# Altium schematic sheet LedPot.SchDoc
size A4; SheetNumber: 2; SheetTotal: 3; SPICEModelCachePPUOGEJA: <root> / <DocumentId>PPUOGEJA</DocumentId> / </root>
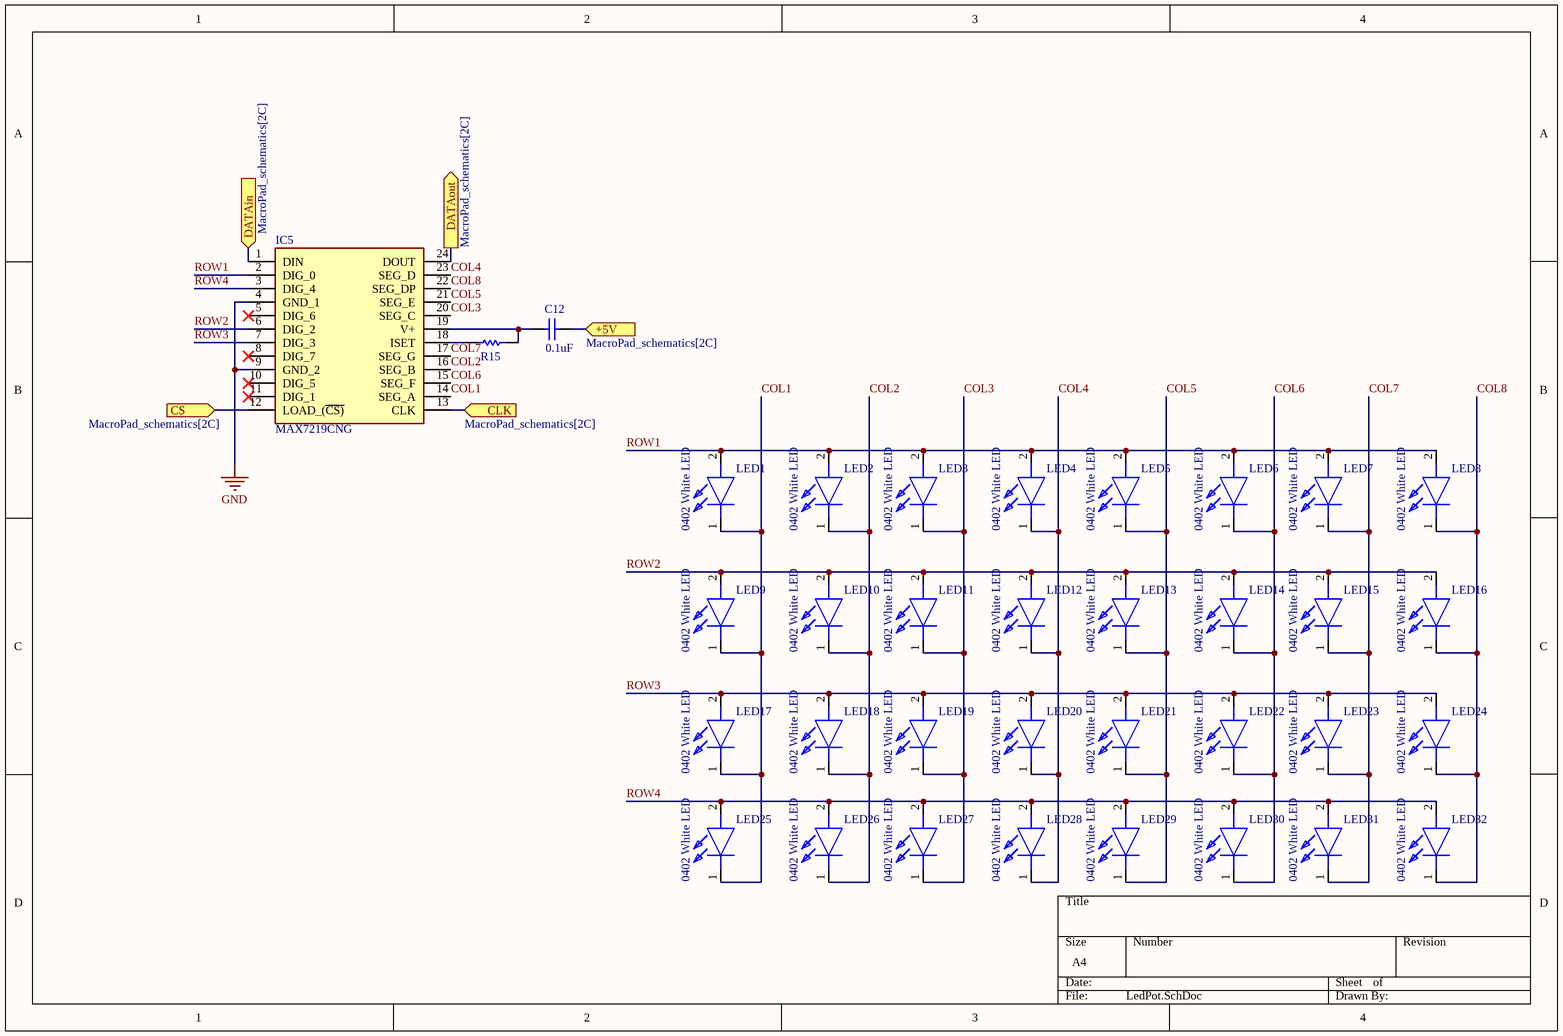
[diagram p0: LedPot.SchDoc]

## Parts
C12  value 0.1uF  [KEMT-1206-2_L]  (hidden comment: 1206 Capacitor)
IC5  MAX7219CNG  [DIP794W56P254L3054H457Q24N]
LED1  0402 White LED  [LWVH8GQ2OO4M6N1]
LED2  0402 White LED  [LWVH8GQ2OO4M6N1]
LED3  0402 White LED  [LWVH8GQ2OO4M6N1]
LED4  0402 White LED  [LWVH8GQ2OO4M6N1]
LED5  0402 White LED  [LWVH8GQ2OO4M6N1]
LED6  0402 White LED  [LWVH8GQ2OO4M6N1]
LED7  0402 White LED  [LWVH8GQ2OO4M6N1]
LED8  0402 White LED  [LWVH8GQ2OO4M6N1]
LED9  0402 White LED  [LWVH8GQ2OO4M6N1]
LED10  0402 White LED  [LWVH8GQ2OO4M6N1]
LED11  0402 White LED  [LWVH8GQ2OO4M6N1]
LED12  0402 White LED  [LWVH8GQ2OO4M6N1]
LED13  0402 White LED  [LWVH8GQ2OO4M6N1]
LED14  0402 White LED  [LWVH8GQ2OO4M6N1]
LED15  0402 White LED  [LWVH8GQ2OO4M6N1]
LED16  0402 White LED  [LWVH8GQ2OO4M6N1]
LED17  0402 White LED  [LWVH8GQ2OO4M6N1]
LED18  0402 White LED  [LWVH8GQ2OO4M6N1]
LED19  0402 White LED  [LWVH8GQ2OO4M6N1]
LED20  0402 White LED  [LWVH8GQ2OO4M6N1]
LED21  0402 White LED  [LWVH8GQ2OO4M6N1]
LED22  0402 White LED  [LWVH8GQ2OO4M6N1]
LED23  0402 White LED  [LWVH8GQ2OO4M6N1]
LED24  0402 White LED  [LWVH8GQ2OO4M6N1]
LED25  0402 White LED  [LWVH8GQ2OO4M6N1]
LED26  0402 White LED  [LWVH8GQ2OO4M6N1]
LED27  0402 White LED  [LWVH8GQ2OO4M6N1]
LED28  0402 White LED  [LWVH8GQ2OO4M6N1]
LED29  0402 White LED  [LWVH8GQ2OO4M6N1]
LED30  0402 White LED  [LWVH8GQ2OO4M6N1]
LED31  0402 White LED  [LWVH8GQ2OO4M6N1]
LED32  0402 White LED  [LWVH8GQ2OO4M6N1]
R15  0402 Resistor  [RESC1005X40X25ML05T05]  (value not drawn)

## Ports
+5V (in, see MacroPad_schematics[2C]), CLK (in, see MacroPad_schematics[2C]), CS (in, see MacroPad_schematics[2C]), DATAin (in, see MacroPad_schematics[2C]), DATAout (out, see MacroPad_schematics[2C])

## Nets
GND: IC5.4(GND_1) IC5.9(GND_2)
+5V: C12.2 ; port +5V
CLK: IC5.13(CLK) ; port CLK
COL1: IC5.14(SEG_A) LED1.1(K) LED9.1(K) LED17.1(K) LED25.1(K)
COL2: IC5.16(SEG_B) LED2.1(K) LED10.1(K) LED18.1(K) LED26.1(K)
COL3: IC5.20(SEG_C) LED3.1(K) LED11.1(K) LED19.1(K) LED27.1(K)
COL4: IC5.23(SEG_D) LED4.1(K) LED12.1(K) LED20.1(K) LED28.1(K)
COL5: IC5.21(SEG_E) LED5.1(K) LED13.1(K) LED21.1(K) LED29.1(K)
COL6: IC5.15(SEG_F) LED6.1(K) LED14.1(K) LED22.1(K) LED30.1(K)
COL7: IC5.17(SEG_G) LED7.1(K) LED15.1(K) LED23.1(K) LED31.1(K)
COL8: IC5.22(SEG_DP) LED8.1(K) LED16.1(K) LED24.1(K) LED32.1(K)
CS: IC5.12(LOAD_(~{CS)}) ; port CS
DATAin: IC5.1(DIN) ; port DATAin
DATAout: IC5.24(DOUT) ; port DATAout
ROW1: IC5.2(DIG_0) LED1.2(A) LED2.2(A) LED3.2(A) LED4.2(A) LED5.2(A) LED6.2(A) LED7.2(A) LED8.2(A)
ROW2: IC5.6(DIG_2) LED9.2(A) LED10.2(A) LED11.2(A) LED12.2(A) LED13.2(A) LED14.2(A) LED15.2(A) LED16.2(A)
ROW3: IC5.7(DIG_3) LED17.2(A) LED18.2(A) LED19.2(A) LED20.2(A) LED21.2(A) LED22.2(A) LED23.2(A) LED24.2(A)
ROW4: IC5.3(DIG_4) LED25.2(A) LED26.2(A) LED27.2(A) LED28.2(A) LED29.2(A) LED30.2(A) LED31.2(A) LED32.2(A)
NetC12_1: C12.1 IC5.19(V+) R15.2
NetIC5_18: IC5.18(ISET) R15.1

Not connected (* = marked no-connect by the designer): IC5 5(DIG_6)* 8(DIG_7)* 10(DIG_5)* 11(DIG_1)*

## Library data of the parts
C12 = CMP-001-00000-5: General Purpose Capacitor; Tolerance: 10%; Capacitor Type: Ceramic; Voltage Rating: 50V; Max Operating Temperature: 125°C; RoHS Compliant: Yes; Min Operating Temperature: -55°C; Case/Package: 1206
IC5 = MAX7219CNG: Integrated Circuit; Manufacturer_Name: Analog Devices; Datasheet Link: https://datasheets.maximintegrated.com/en/ds/MAX7219-MAX7221.pdf; Height: 4.572mm; Manufacturer_Part_Number: MAX7219CNG; Mouser Part Number: 700-MAX7219CNG-NR; Mouser Price/Stock: https://www.mouser.co.uk/ProductDetail/Analog-Devices-Maxim-Integrated/MAX7219CNG?qs=p6VZ%252BklCkRToQRlZGegBBA%3D%3D
LED1-LED32 = LW_VH8G-Q2OO-4M6N-1: LED; Manufacturer_Name: ams OSRAM; Manufacturer_Part_Number: LW VH8G-Q2OO-4M6N-1; Datasheet Link: https://look.ams-osram.com/m/6a061397583b7b2c/original/LW-VH8G.pdf; Height: 0.35mm; Mouser Part Number: 720-LWVH8G-Q2S24M6N1; Mouser Price/Stock: https://www.mouser.co.uk/ProductDetail/ams-OSRAM/LW-VH8G-Q2OO-4M6N-1?qs=%252BEew9%252B0nqrAt4wn7N3MZJQ%3D%3D
R15 = CMP-009-00003-5: General Purpose 0402 Resistor; Rated Temperature: 70°C; Rated Power Dissipation (P): 100mW; Tolerance: 1%; Reference Standard: AEC-Q200; Package Height: 0.35mm; Package Width: 0.5mm; Temperature Coefficient: 100ppm/°C; Resistance: 100R; Working Voltage: 50V; Package Length: 1mm; Terminal Finish: Nickel; Package Shape: Rectangular; Construction: Rectangular; RoHS Compliant: Yes; REACH SVHC: Yes; Technology: METAL GLAZE/THICK FILM; Termination: Wraparound; Mount: Surface Mount; Min Operating Temperature: -55°C; Number of Pins: 2; Packaging: Tape and Reel; Package Style: SMTMeter; JESD-609 Code: e3; Size Code: 0402; Max Operating Temperature: 155°C; Resistor Type: FIXED RESISTOR